# Altium schematic sheet FTDI_USB_UART.SchDoc
size A; DocumentNumber: 1; SheetNumber: 1; SheetTotal: 12
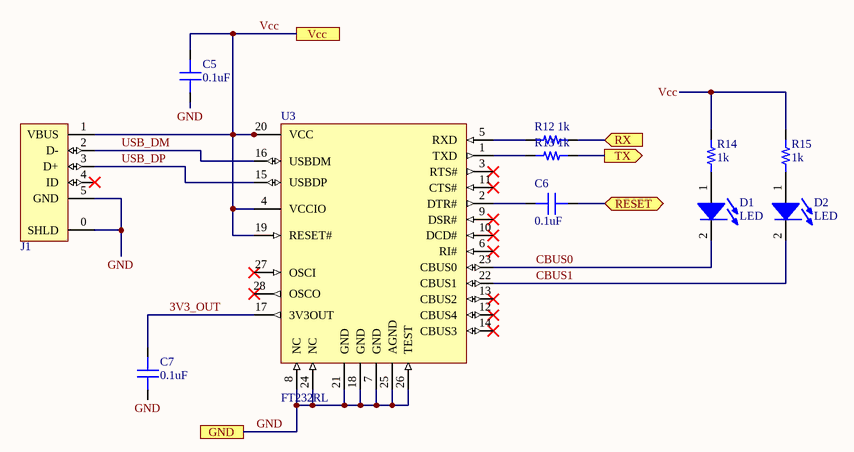
[diagram p0: FTDI_USB_UART.SchDoc]

## Parts
C5  capacitance: 0.1uF  [0603]  (hidden comment: capacitor)
C6  capacitance: 0.1uF  [0603]  (hidden comment: capacitor)
C7  capacitance: 0.1uF  [0603]  (hidden comment: capacitor)
D1  LED  [0805_LED]
D2  LED  [0805_LED]
J1  USB Micro  [ZX62WRD-B-5PC]  (value not drawn)
R12  1k  [RES 0603/1608]
R13  1k  [RES 0603/1608]
R14  1k  [RES 0603/1608]
R15  1k  [RES 0603/1608]
U3  FT232RL  [SSOP-28]

## Ports
GND, RESET (bidir), RX (in), TX (out), Vcc

## Nets
3V3_OUT: C7.2 U3.17(3V3OUT)
CBUS0: D1.2(K) U3.23(CBUS0)
CBUS1: D2.2(K) U3.22(CBUS1)
GND: C5.1 C7.1 J1.0(SHLD) J1.5(GND) U3.7(GND) U3.8(NC) U3.18(GND) U3.21(GND) U3.24(NC) U3.25(AGND) U3.26(TEST) ; port GND
RESET: C6.1 ; port RESET
RX: R12.2 ; port RX
TX: R13.2 ; port TX
USB_DM: J1.2(D-) U3.16(USBDM)
USB_DP: J1.3(D+) U3.15(USBDP)
Vcc: C5.2 J1.1(VBUS) R14.2 R15.2 U3.4(VCCIO) U3.19(RESET#) U3.20(VCC) ; port Vcc
NetC6_2: C6.2 U3.2(DTR#)
NetD1_1: D1.1(A) R14.1
NetD2_1: D2.1(A) R15.1
NetR12_1: R12.1 U3.5(RXD)
NetR13_1: R13.1 U3.1(TXD)

Not connected (* = marked no-connect by the designer): J1 4(ID)*; U3 3(RTS#)* 6(RI#)* 9(DSR#)* 10(DCD#)* 11(CTS#)* 12(CBUS4)* 13(CBUS2)* 14(CBUS3)* 27(OSCI)* 28(OSCO)*

## Library data of the parts
C5-C7 = 1: Generic 0603 capacitor; id: 1
D1 D2 = 19: Generic 0805 LED; id: 19
J1 = 29: Micro USB; id: 29
R12-R15 = 1: id: 1; name: 0603 Resistor; percent tolerance: 5; resistance: 1k; package: 0603; quantity: 0
U3 = 3: id: 3; name: null; vcc: 0; type: UART; quantity: 0; link: https://www.digikey.com/product-detail/en/ftdi-future-technology-devices-international-ltd/FT232RL-REEL/768-1007-1-ND/1836402